# EAGLE design MankenMotor (EAGLE 9.6.1)
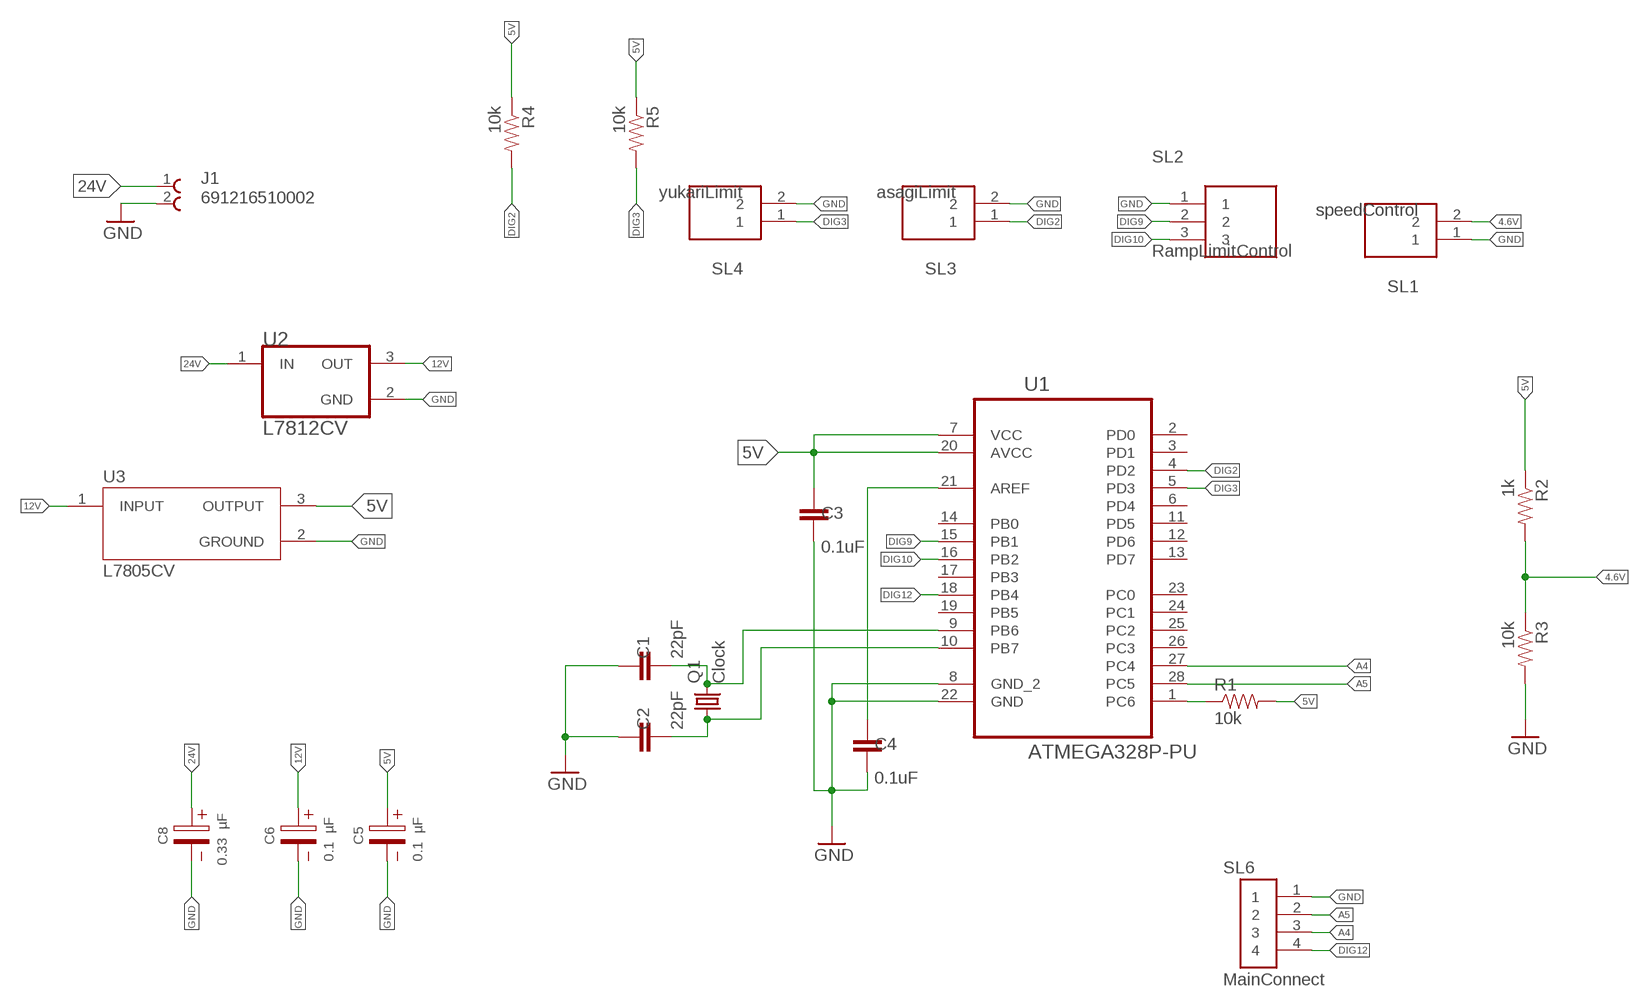
[diagram p0: schematic, sheet 1]

## Parts
C1  22pF  22PF-PTH-2.54MM-200V-5%  [CAP-PTH-2.54]
C2  22pF  22PF-PTH-2.54MM-200V-5%  [CAP-PTH-2.54]
C3  0.1uF  0.1UF-KIT-EZ-50V-20%  [CAP-PTH-SMALL-KIT]
C4  0.1uF  0.1UF-KIT-EZ-50V-20%  [CAP-PTH-SMALL-KIT]
C5  0.1 µF  WCAP-ATG5_5X11_860020772001  [WCAP-ATG5_5X11(DXL)]
C6  0.1 µF  WCAP-ATG5_5X11_860020772001  [WCAP-ATG5_5X11(DXL)]
C8  0.33 µF  WCAP-ATG5_5X11_860020772003  [WCAP-ATG5_5X11(DXL)]
J1  691216510002  [691216510002]
Q1  Clock  CRYSTALHC49S  [HC49/S]
R1  10k  10KOHM-HORIZ-1/4W-5%  [AXIAL-0.3]
R2  1k  1KOHM-HORIZ-1/4W-5%  [AXIAL-0.3]
R3  10k  10KOHM-HORIZ-1/4W-5%  [AXIAL-0.3]
R4  10k  10KOHM-HORIZ-1/4W-5%  [AXIAL-0.3]
R5  10k  10KOHM-HORIZ-1/4W-5%  [AXIAL-0.3]
SL1  speedControl  B2B-XH-A(LF)(SN)  [JST_B2B-XH-A(LF)(SN)]
SL2  RampLimitControl  B3B-XH-A_LF__SN_  [SHDR3W64P0X250_1X3_990X575X700]
SL3  asagiLimit  B2B-XH-A(LF)(SN)  [JST_B2B-XH-A(LF)(SN)]
SL4  yukariLimit  B2B-XH-A(LF)(SN)  [JST_B2B-XH-A(LF)(SN)]
SL6  MainConnect  B4B-XH-A(LF)(SN)  [JST_B4B-XH-A(LF)(SN)]
U1  ATMEGA328P-PU  [DIP254P762X457-28]
U2  L7812CV  [TO-220-3]
U3  L7805CV  [TO255P1040X460X1968-3]

## Nets
4.6V: R2.P$2 R3.P$1 SL1.2
5V: C3.1 C5.1(+) R1.P$2 R2.P$1 R4.P$1 R5.P$1 U1.7(VCC) U1.20(AVCC) U3.3(OUTPUT)
12V: C6.1(+) U2.3(OUT) U3.1(INPUT)
24V: C8.1(+) J1.1 U2.1(IN)
A4: SL6.3 U1.27(PC4)
A5: SL6.2 U1.28(PC5)
DIG2: R4.P$2 SL3.1 U1.4(PD2)
DIG3: R5.P$2 SL4.1 U1.5(PD3)
DIG9: SL2.2 U1.15(PB1)
DIG10: SL2.3 U1.16(PB2)
DIG12: SL6.4 U1.18(PB4)
GND: C1.1 C2.1 C3.2 C4.2 C5.2(-) C6.2(-) C8.2(-) J1.2 R3.P$2 SL1.1 SL2.1 SL3.2 SL4.2 SL6.1 U1.8(GND_2) U1.22(GND) U2.2(GND) U3.2(GROUND)
N$1: R1.P$1 U1.1(PC6)
N$4: C1.2 Q1.2 U1.9(PB6)
N$5: C2.2 Q1.1 U1.10(PB7)
N$6: C4.1 U1.21(AREF)
Unconnected: U1.2(PD0) U1.3(PD1) U1.6(PD4) U1.11(PD5) U1.12(PD6) U1.13(PD7) U1.14(PB0) U1.17(PB3) U1.19(PB5) U1.23(PC0) U1.24(PC1) U1.25(PC2) U1.26(PC3)

## Library data of the parts
C1 C2 = SparkFun-Capacitors-01uf:22PF: 22pF ceramic capacitors A capacitor is a passive two-terminal electrical component used to store electrical energy temporarily in an electric field.; PROD_ID: CAP-09128
C3 C4 = SparkFun-Capacitors-01uf:0.1UF: 0.1µF ceramic capacitors A capacitor is a passive two-terminal electrical component used to store electrical energy temporarily in an electric field.; PROD_ID: CAP-08370
C5 C6 = Wurth_Capacitors_WCAP-ATG5-01uf-033uf:WCAP-ATG5_5X11: WCAP-ATG5 Aluminium Electrolytic Capacitors General Purpose +105 °C Characteristics General purpose product series with max. operating temperature of +105 °C Mounting style: THT Radial Capacitance range: 0.1 µF ‒ 18000 µF Capacitance tolerance: ±20 % Operating temperature: -40 °C up to +105 °C for UR < 400 V(DC) -25 °C up to +105 °C for UR ≥ 400 V(DC) Endurance: 2000 h @ +105 °C Dimensions (DxL) in mm: 5.0 x 11.0 up to 22.0 x 31.0 Recommended soldering: Wave soldering Applications Filtering Smoothing Energy storage Coupling e.g. Switched-mode power supply, AC/DC converter, adapter, charger, digital camera <https://www.we-online.com/catalog/media/o35284v209%20WCAP-ATG5_4C.jpg> Details see: https://www.we-online.com/catalog/en/WCAP-ATG5/ Updated by yingchun,Shan;2020-02-28 2020(C) Würth Elektronik; DATASHEET-URL: https://www.we-online.com/catalog/datasheet/860020772001.pdf; DF: 9%; DIAMETER: 5mm; I-LEAK: 3uA; I-RIPPLE: 1.3mA; L: 11mm; OPERATING-TEMPERATURE: -40 °C up to +105 °C; PART-NUMBER: 860020772001; PITCH: 2mm; TECHNICAL-REFERENCE: ATDC110R10M063DSPA3B000; VR: 63V(DC)
C8 = Wurth_Capacitors_WCAP-ATG5-01uf-033uf:WCAP-ATG5_5X11: WCAP-ATG5 Aluminium Electrolytic Capacitors General Purpose +105 °C Characteristics General purpose product series with max. operating temperature of +105 °C Mounting style: THT Radial Capacitance range: 0.1 µF ‒ 18000 µF Capacitance tolerance: ±20 % Operating temperature: -40 °C up to +105 °C for UR < 400 V(DC) -25 °C up to +105 °C for UR ≥ 400 V(DC) Endurance: 2000 h @ +105 °C Dimensions (DxL) in mm: 5.0 x 11.0 up to 22.0 x 31.0 Recommended soldering: Wave soldering Applications Filtering Smoothing Energy storage Coupling e.g. Switched-mode power supply, AC/DC converter, adapter, charger, digital camera <https://www.we-online.com/catalog/media/o35284v209%20WCAP-ATG5_4C.jpg> Details see: https://www.we-online.com/catalog/en/WCAP-ATG5/ Updated by yingchun,Shan;2020-02-28 2020(C) Würth Elektronik; DATASHEET-URL: https://www.we-online.com/catalog/datasheet/860020772003.pdf; DF: 9%; DIAMETER: 5mm; I-LEAK: 3uA; I-RIPPLE: 4.5mA; L: 11mm; OPERATING-TEMPERATURE: -40 °C up to +105 °C; PART-NUMBER: 860020772003; PITCH: 2mm; TECHNICAL-REFERENCE: ATDC110R33M063DSPA3B000; VR: 63V(DC)
J1 = 691216510002:691216510002: WR-TBL Serie 2165 - 5.08mm Horizontal Entry Modular with Rising Cage Clamp - 3.5mm2 Wires, 2 Pins=>Code : Con_TBL_Screw_RisingClamp_5.08_691216510002 <http://katalog.we-online.de/media/images/eican/Con_TBL_Screw_RisingClamp_5.08_6912165100xx_pf2.jpg> Details see: http://katalog.we-online.de/en/em/691_216_510_0xx Created 2014-06-18, Karrer Zheng 2014 (C) Würth Elektronik; AVAILABILITY: Unavailable; DESCRIPTION: 2 Position Wire to Board Terminal Block Horizontal with Board 0.200 (5.08mm) Through Hole; MF: Wurth Electronics; MP: 691216510002; PACKAGE: None; PRICE: None
Q1 = adafruitHC-49S(Buyuk):CRYSTAL: CRYSTAL; OC_FARNELL: 1667008; OC_NEWARK: unknown
R1 R3-R5 = SparkFun-Resistors-10k:10KOHM: 10kΩ resistor A resistor is a passive two-terminal electrical component that implements electrical resistance as a circuit element. Resistors act to reduce current flow, and, at the same time, act to lower voltage levels within circuits. - Wikipedia; PROD_ID: RES-09435
R2 = SparkFun-Resistors-1k:1KOHM: 1kΩ resistor A resistor is a passive two-terminal electrical component that implements electrical resistance as a circuit element. Resistors act to reduce current flow, and, at the same time, act to lower voltage levels within circuits. - Wikipedia; PROD_ID: RES-08380
SL1 SL3 SL4 = B2B-XH-A_LF__SN_:B2B-XH-A(LF)(SN): XH Series 2 Position 2.5 mm Pitch Through Hole Top Entry Shrouded Header; ARROW_ELECTRONICS-PURCHASE-URL: https://snapeda.com/shop?store=Arrow+Electronics&id=492310; DESCRIPTION: Connector Header Through Hole 2 position 0.098 (2.50mm); DIGI-KEY_PART_NUMBER: 455-2247-ND; DIGIKEY-PURCHASE-URL: https://snapeda.com/shop?store=DigiKey&id=492310; MF: JST Sales; MP: B2B-XH-A(LF)(SN); PACKAGE: None
SL2 = B3B-XH-A_LF__SN_:B3B-XH-A_LF__SN_: XH-2.5mm Header top entry 3 way JST XH Series, Series Number B3B, 2.5mm Pitch 3 Way 1 Row Straight PCB Header, Solder Termination, 3A Source: Datasheet <http://docs-emea.rs-online.com/webdocs/1357/0900766b81357f2f.pdf>; ARROW_PART_NUMBER: B3B-XH-A(LF)(SN); ARROW_PRICE-STOCK: https://www.arrow.com/en/products/b3b-xh-a-lf-sn/jst-manufacturing; DESCRIPTION: XH-2.5mm Header top entry 3 way JST XH Series, Series Number B3B, 2.5mm Pitch 3 Way 1 Row Straight PCB Header, Solder Termination, 3A; HEIGHT: 7mm; MANUFACTURER_NAME: JST (JAPAN SOLDERLESS TERMINALS); MANUFACTURER_PART_NUMBER: B3B-XH-A(LF)(SN)
SL6 = B4B-XH-A_LF__SN_:B4B-XH-A(LF)(SN): XH Series 4 Position 2.5 mm Pitch Through Hole Crimp Top Entry Shrouded Header; DESCRIPTION: Connector Header Through Hole 4 position 0.098 (2.50mm); DIGI-KEY_PART_NUMBER: 455-2249-ND; MF: JST Sales; MP: B4B-XH-A(LF)(SN); PACKAGE: None
U1 = atmega328p:ATMEGA328P-PU: 8-bit Microcontroller with In-System Programmable Flash; MPN: ATMEGA328P-PU; OC_FARNELL: 1715487; OC_NEWARK: 68T2944; PACKAGE: PDIP-28; SUPPLIER: Atmel
U2 = L7812CV:L7812CV: IC REG LINEAR 12V 1.5A TO220AB; DESCRIPTION: Linear Voltage Regulator IC 1 Output 1.5A TO-220; DIGI-KEY_PART_NUMBER: 497-12406-ND; MF: STMicroelectronics; MP: L7812CV; PACKAGE: TO-220 Texas Instruments
U3 = L7805CV:L7805CV: Standard Regulator Pos 5V 1.5A 3-Pin(3+Tab) TO-220 Standard Regulator Pos 5V 1.5A 3-Pin(3+Tab) TO-220; DESCRIPTION: Linear Voltage Regulator IC 1 Output 1.5A TO-220; DIGI-KEY_PART_NUMBER: 497-12404-ND; MF: STMicroelectronics; MP: L7805CV; PACKAGE: TO-220 STMicroelectronics

## Board
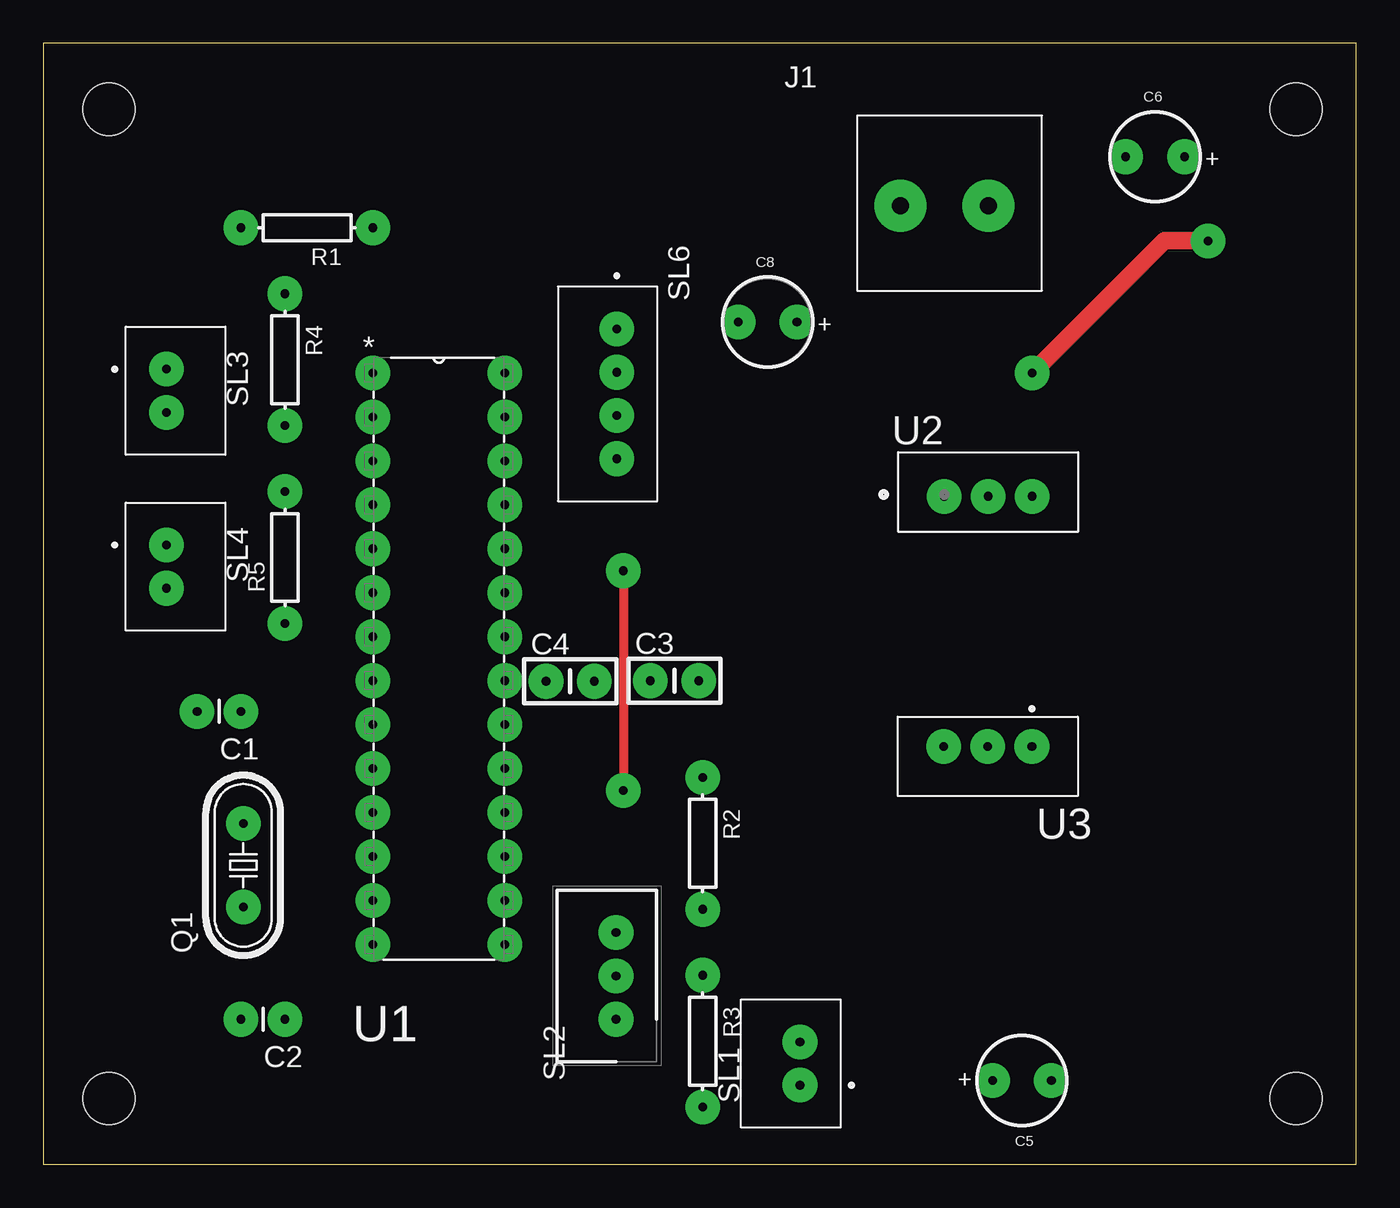
[diagram p1: board, top side]
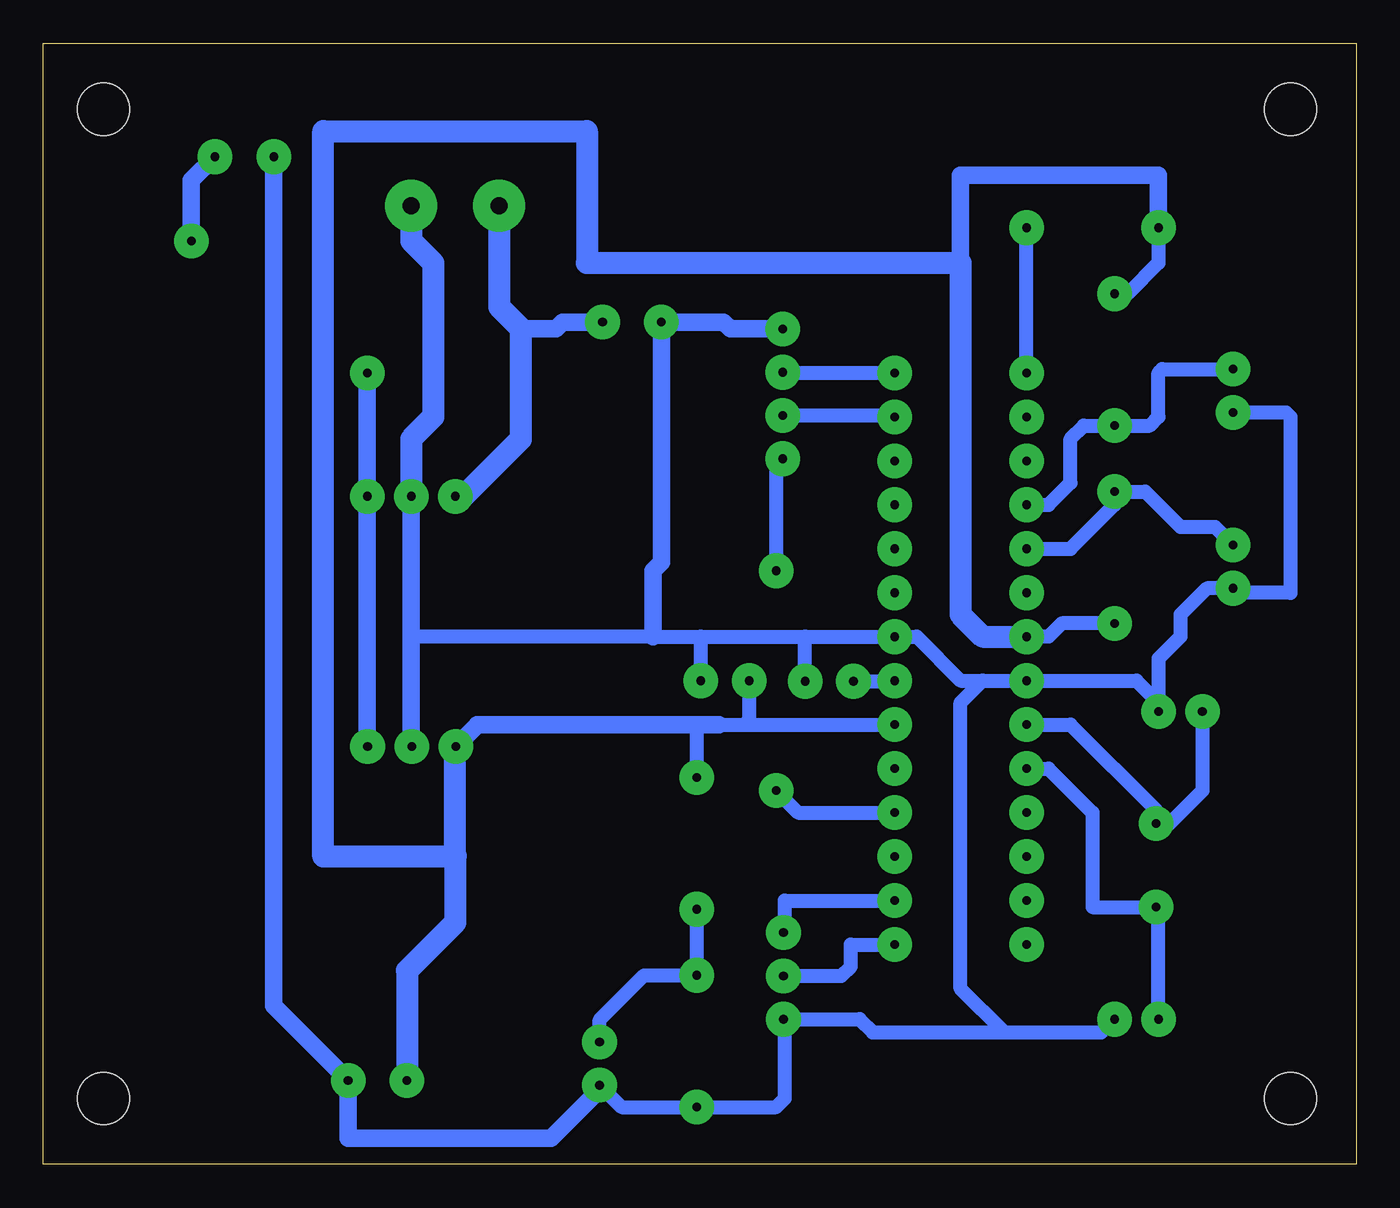
[diagram p2: board, bottom side, seen from below]

Size 75.87 x 64.76 mm. Coordinates in mm from the lower left corner, seen from the top.
Outline: 0,0 75.87,0 75.87,64.76 0,64.76 0,0
Copper layers (1*16): Top 0.035mm / dielectric 1.5mm / Bottom 0.035mm
Design rules "default": minimum track width 6mil, minimum drill 0.35mm, track to track 6mil, track to pad 6mil, pad to pad 6mil, via to via 6mil, smd to smd 6mil, copper to edge 40mil, drill to drill 6mil, minimum pad ring 10mil, minimum via ring 8mil, stop-mask expansion 4mil, vias tented up to drill 0mil, thermal gap 10mil
Holes 3 mm at 3.8,60.95 72.4,60.95 3.8,3.8 72.4,3.8

### Footprints (pad centres in the part's own frame; a part is rotated, then mirrored left to right if it is on the bottom)
CAP-PTH-2.54 = drill 0.5 pad 2: 1 -1.27,0; 2 1.27,0
CAP-PTH-SMALL-KIT = drill 0.5 pad 2: 1 -1.397,0; 2 1.397,0
WCAP-ATG5_5X11(DXL) = drill 0.5 pad 2: 1 1.7,0; 2 -1.7,0
691216510002 = drill 1 pad 3: 1 -5.08,0; 2 0,0
HC49/S = drill 0.5 pad 2: 1 -2.413,0; 2 2.413,0
AXIAL-0.3 = drill 0.5 pad 2: P$1 -3.81,0; P$2 3.81,0
JST_B2B-XH-A(LF)(SN) = drill 0.5 pad 2: 1 -1.25,-0.525; 2 1.25,-0.525
SHDR3W64P0X250_1X3_990X575X700 = drill 0.5 pad 2: 1 0,0; 2 2.5,0; 3 5,0
JST_B4B-XH-A(LF)(SN) = drill 0.5 pad 2: 1 0,0; 2 2.5,0; 3 5,0; 4 7.5,0
DIP254P762X457-28 = drill 0.5 pad 2: 1 -7.62,33.02; 2 -7.62,30.48; 3 -7.62,27.94; 4 -7.62,25.4; 5 -7.62,22.86; 6 -7.62,20.32; 7 -7.62,17.78; 8 -7.62,15.24; 9 -7.62,12.7; 10 -7.62,10.16; 11 -7.62,7.62; 12 -7.62,5.08; 13 -7.62,2.54; 14 -7.62,0; 15 0,0; 16 0,2.54; 17 0,5.08; 18 0,7.62; 19 0,10.16; 20 0,12.7; 21 0,15.24; 22 0,17.78; 23 0,20.32; 24 0,22.86; 25 0,25.4; 26 0,27.94; 27 0,30.48; 28 0,33.02
TO-220-3 = drill 0.5 pad 2: 1 -2.55,-0.26; 2 0,-0.26; 3 2.55,-0.26
TO255P1040X460X1968-3 = drill 0.5 pad 2: 1 0,0; 2 2.55,0; 3 5.1,0

### Placement (x,y rotation side)
C1  10.16,26.16 180 top
C2  12.7,8.38 180 top
C3  36.47,27.94 0 top
C4  30.45,27.91 0 top
C5  56.55,4.85 180 top
C6  64.25,58.2 0 top
C8  41.85,48.65 0 top
J1  54.61,55.38 0 top
Q1  11.56,17.27 90 top
R1  15.24,54.11 180 top
R2  38.1,18.55 270 top
R3  38.1,7.11 270 top
R4  13.97,46.48 270 top
R5  13.97,35.05 90 top
SL1  43.2,5.82 90 top
SL2  33.1,8.38 90 top
SL3  7.64,44.69 270 top
SL4  7.64,34.53 270 top
SL6  33.14,48.26 270 top
U1  26.67,12.7 0 top
U2  54.6,38.85 0 top
U3  57.13,24.13 180 top

### Tracks (layer width: path | path; a pad name or v marks a point on that pad's centre or on a via)
4.6V
  Bottom 0.813: SL1.2 43.73,8.34 41.15,10.93 R3.P$1 R2.P$2
5V
  Bottom 0.813: 36.83,25.4 35.35,25.4 | 35.35,25.4 U1.20 | R2.P$1 38.1,25.4 | R5.P$1 17.02,31.24 17.78,30.48 U1.7 | R1.P$2 11.43,52.07 13.21,50.3 R4.P$1 | C3.1 35.08,25.67 35.35,25.4
  Bottom 1.016: U3.3 50.8,25.36 50.8,25.4 38.1,25.4 36.83,25.4 | 22.86,52.07 22.86,57.15 11.43,57.15 R1.P$2
  Bottom 1.27: 52.07,17.78 59.69,17.78 59.69,59.69 44.45,59.69 44.45,52.07 22.86,52.07 22.86,31.75 21.59,30.48 U1.7 | 52.07,17.78 52.07,13.97 54.85,11.19 C5.1 | 52.03,17.82 52.07,17.78 | 52.07,17.78 52.07,24.09 U3.3
12V  (via drill 0.5 pad 2)
  Top 1.016: v57.15,45.72 64.77,53.34 v67.31,53.34
  Bottom 1.016: v57.15,45.72 U2.3 57.15,24.15 U3.1 | v67.31,53.34 67.31,56.84 C6.1
24V
  Bottom 1.016: 48.26,48.26 46.24,48.26 45.85,48.65 C8.1
  Bottom 1.27: J1.1 49.53,49.53 48.26,48.26 48.29,48.26 48.29,41.88 51.58,38.59 U2.1
A4
  Bottom 0.813: SL6.3 26.75,43.26 U1.27
A5
  Bottom 0.813: SL6.2 33.1,45.72 U1.28
DIG2
  Bottom 0.813: U1.4 17.78,38.1 16.51,39.37 16.51,41.91 15.74,42.68 R4.P$2 11.93,42.68 11.43,43.18 11.43,45.72 11.21,45.94 SL3.1
DIG3
  Bottom 0.813: U1.5 16.51,35.56 13.97,38.1 R5.P$2 12.2,38.87 10.16,36.83 8.16,36.83 SL4.1
DIG9
  Bottom 0.813: SL2.2 29.76,10.88 29.21,11.43 29.21,12.7 U1.15
DIG10
  Bottom 0.813: SL2.3 33.02,13.46 33.02,15.24 U1.16
DIG12  (via drill 0.5 pad 2)
  Top 0.508: v33.52,34.29 v33.52,21.59
  Bottom 0.813: SL6.4 33.52,40.38 v33.52,34.29 | v33.52,21.59 32.25,20.32 U1.18
GND
  Bottom 0.813: 37.87,30.48 40.64,30.48 54.61,30.48 | 37.87,30.48 31.85,30.48 | 31.85,30.48 U1.22 25.4,30.48 22.86,27.94 21.59,27.94 | 21.59,27.94 U1.8 12.7,27.94 11.43,26.67 C1.1 11.43,29.21 10.16,30.48 10.16,31.75 8.63,33.28 SL4.2 6.85,33.02 3.81,33.02 3.81,43.18 4.07,43.44 SL3.2 | 20.32,7.62 22.86,10.16 22.86,26.67 21.59,27.94 | 20.32,7.62 27.94,7.62 28.7,8.38 SL2.1 33.02,8.3 33.02,3.81 33.52,3.3 R3.P$2 42.45,3.3 SL1.1 | C3.2 37.87,30.48 | C4.2 31.85,30.48 | 20.32,7.62 14.73,7.62 C2.1
  Bottom 1.016: SL1.1 43.73,4.31 46.52,1.52 58.25,1.52 C5.2 62.55,9.15 C6.2 | U2.2 54.61,30.48 54.61,24.16 U3.2 | 40.64,30.48 40.64,34.29 40.15,34.78 C8.2 36.55,48.65 36.16,48.26 SL6.1
  Bottom 1.27: J1.2 54.61,53.34 53.34,52.07 53.34,43.18 54.61,41.91 U2.2
N$1
  Bottom 0.813: U1.1 R1.P$1
N$4
  Bottom 0.813: U1.9 16.51,25.4 11.56,20.45 Q1.2 10.79,19.69 8.89,21.59 C1.2
N$5
  Bottom 0.813: C2.2 11.43,14.73 Q1.1 15.24,14.86 15.24,20.32 17.78,22.86 U1.10
N$6
  Bottom 0.813: C4.1 26.7,27.91 U1.21